# Altium schematic sheet power-amplifiers.SchDoc: Power Amplifiers
size A3; DocumentNumber: 5; SheetNumber: 5; SheetTotal: 9
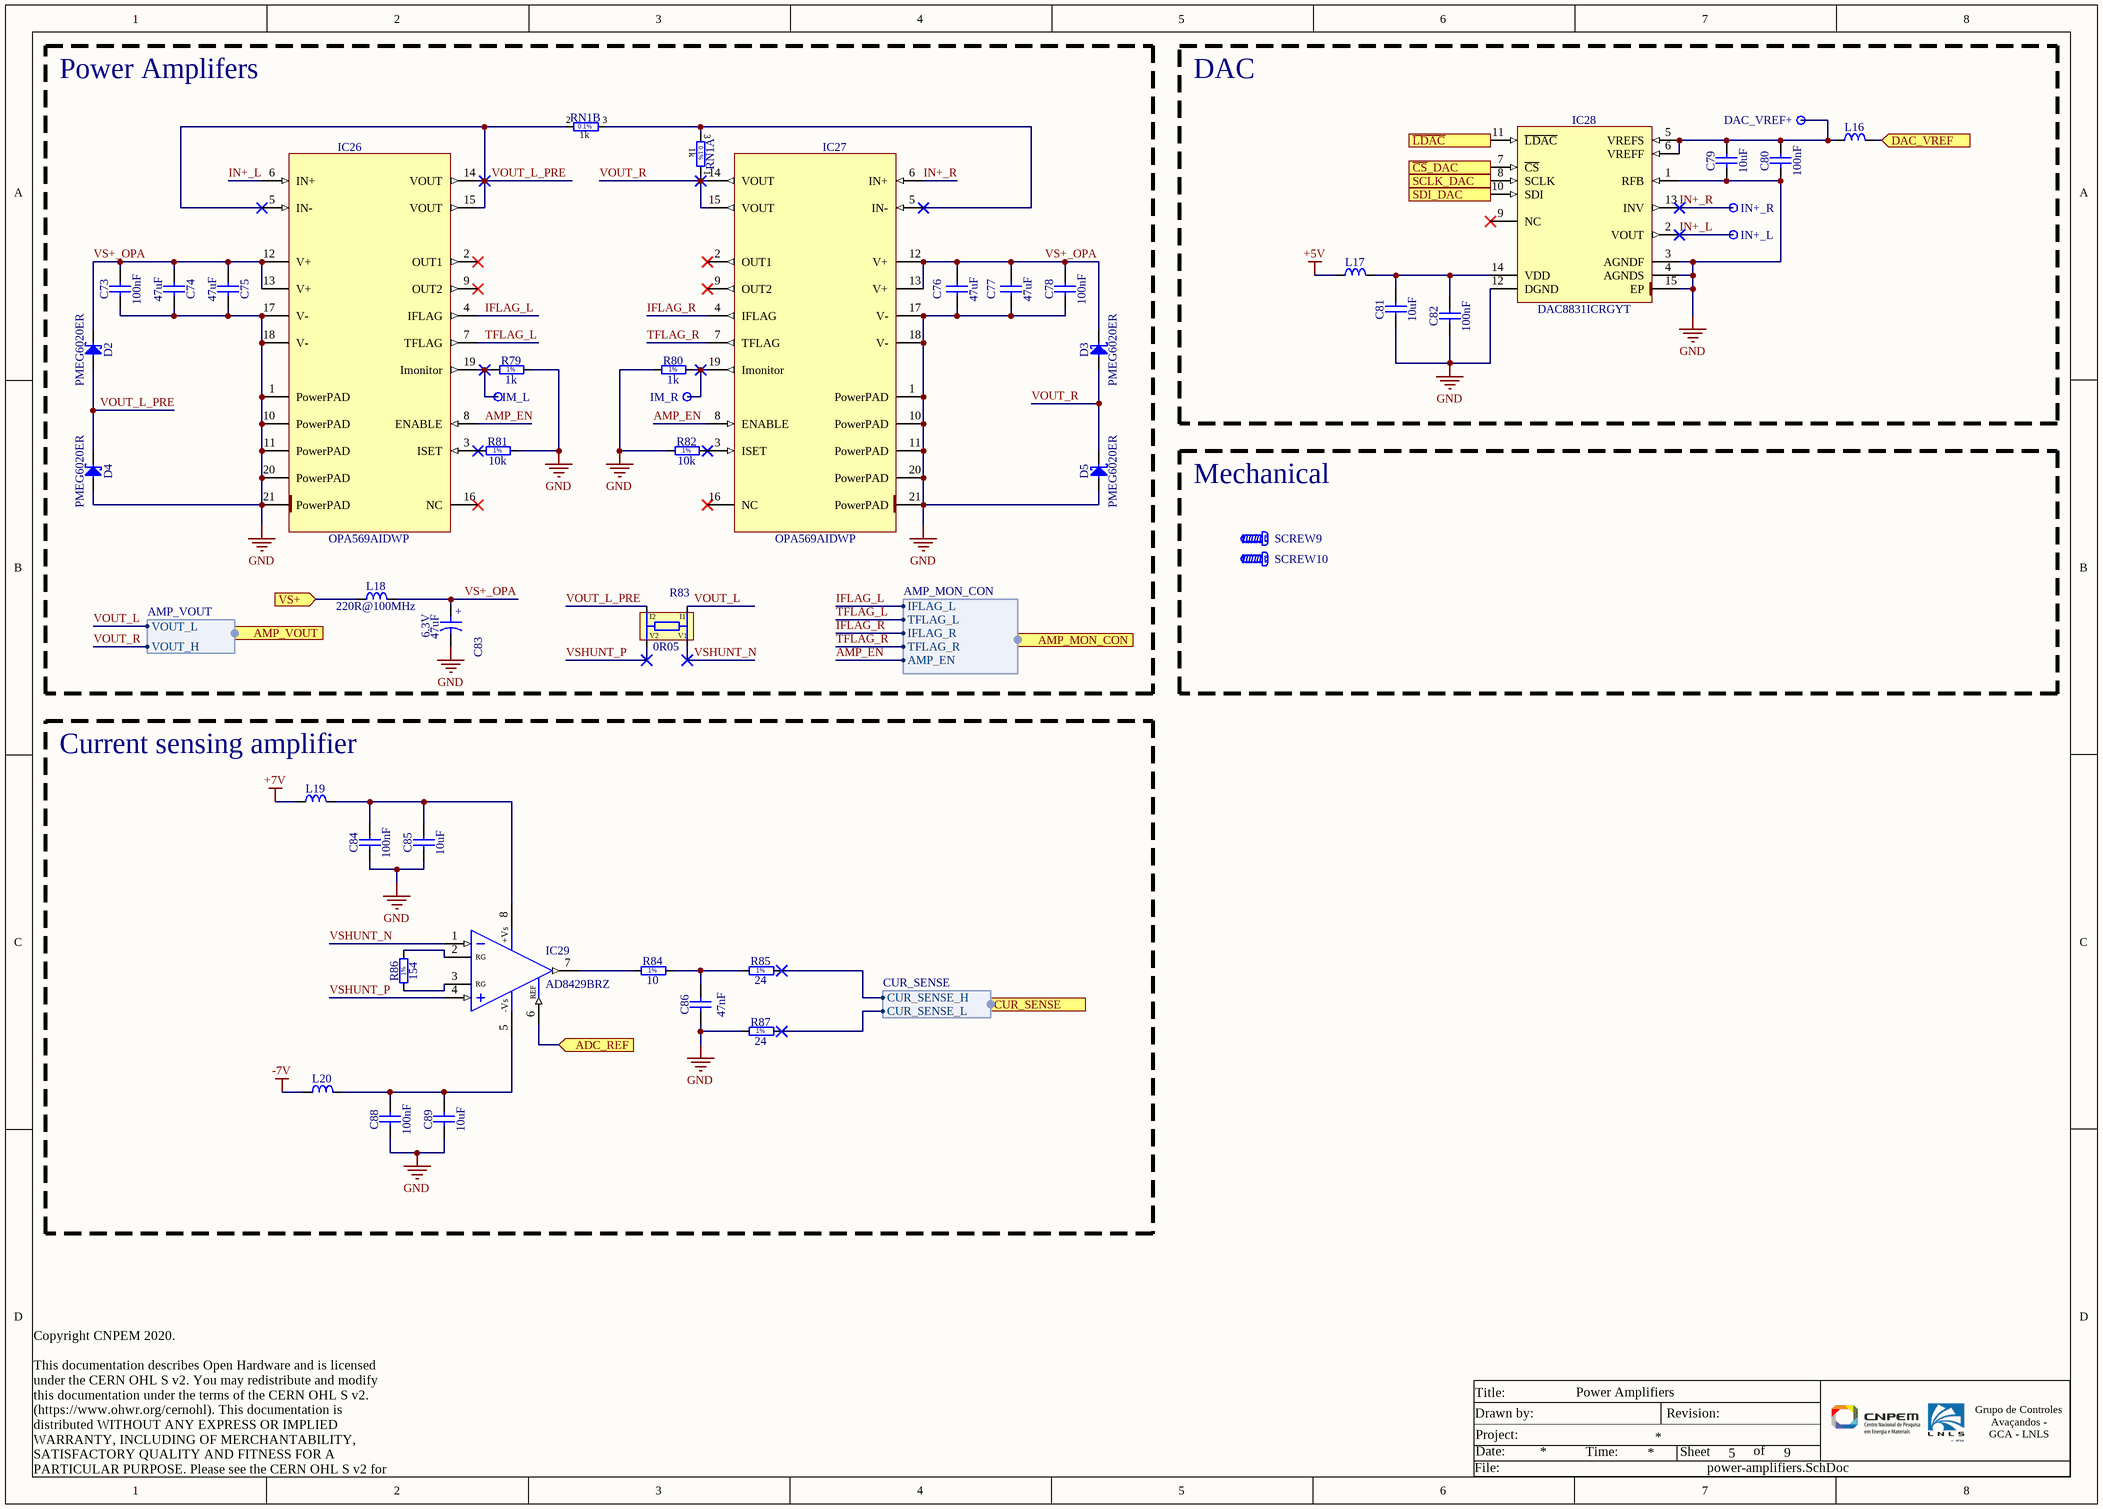
[diagram p0: power-amplifiers.SchDoc]

## Parts
C73  100nF  [CAPC1005X55N]
C74  47uF  [CAPC2012X140N]
C75  47uF  [CAPC2012X140N]
C76  47uF  [CAPC2012X140N]
C77  47uF  [CAPC2012X140N]
C78  100nF  [CAPC1005X55N]
C79  10uF  [CAPC2012X95N]
C80  100nF  [CAPC1005X55N]
C81  10uF  [CAPC2012X95N]
C82  100nF  [CAPC1005X55N]
C83  47uF  Voltage: 6.3V  [CAPMP3528X210N]
C84  100nF  [CAPC1608X87N]
C85  10uF  [CAPC2012X95N]
C86  47nF  [CAPC2012X135N]
C88  100nF  [CAPC1608X87N]
C89  10uF  [CAPC2012X95N]
D2  PMEG6020ER  [SODFL3517X110N]
D3  PMEG6020ER  [SODFL3517X110N]
D4  PMEG6020ER  [SODFL3517X110N]
D5  PMEG6020ER  [SODFL3517X110N]
DAC_VREF+  Test Point  [TPS127]  (value not drawn)
IC26  OPA569AIDWP  [SOIC127P1030X265-21N-R381X432-TB]
IC27  OPA569AIDWP  [SOIC127P1030X265-21N-R381X432-TB]
IC28  DAC8831ICRGYT  [TEXAS_RGY (S-PVQFN–N14) Simple]
IC29  AD8429BRZ  [SOIC127P600X175-8N]
IM_L  Test Point  [TPS127]  (value not drawn)
IM_R  Test Point  [TPS127]  (value not drawn)
IN+_L  Test Point  [TPS127]  (value not drawn)
IN+_R  Test Point  [TPS127]  (value not drawn)
L16  1K@100MHz  [INDC1608X95N]  (value not drawn)
L17  1K@100MHz  [INDC1608X95N]  (value not drawn)
L18  220R@100MHz  [INDC2012X105N]
L19  1K@100MHz  [INDC1608X95N]  (value not drawn)
L20  1K@100MHz  [INDC1608X95N]  (value not drawn)
R79  1k  [RESC1005X40N]
R80  1k  [RESC1005X40N]
R81  10k  [RESC1005X40N]
R82  10k  [RESC1005X40N]
R83  0R05  [RES_VISHAY_WSK1206]
R84  10  [RESC1005X40N]
R85  24  [RESC1005X40N]
R86  154  [RESC1608X55N]
R87  24  [RESC1005X40N]
RN1  1k 1k  [SOT95P230X112-3N]  (value not drawn)  (parts A,B of 2)
SCREW9  M2x6  [MCMASTERCARR_90910A922_V]  (value not drawn)
SCREW10  M2x6  [MCMASTERCARR_90910A922_V]  (value not drawn)

## Blocks framed on the sheet
Power Amplifers: C73-C78 C83 D2-D5 IC26 IC27 IM_L IM_R L18 R79-R83 RN1
DAC: C79-C82 DAC_VREF+ IC28 IN+_L IN+_R L16 L17
Mechanical: SCREW9 SCREW10
Current sensing amplifier: C84-C86 C88 C89 IC29 L19 L20 R84-R87

## Ports
ADC_REF (in), AMP_MON_CON (harness AMP_MON_CON), AMP_VOUT (harness AMP_VOUT), CUR_SENSE (harness CUR_SENSE), DAC_VREF (in), SCLK_DAC (in), SDI_DAC (in), VS+ (in), ~{CS}_DAC (in), ~{LDAC} (in)

## Harnesses
AMP_MON_CON: IFLAG_L, TFLAG_L, IFLAG_R, TFLAG_R, AMP_EN
AMP_VOUT: VOUT_L, VOUT_H
CUR_SENSE: CUR_SENSE_H, CUR_SENSE_L

## Nets
+5V: L17.1
+7V: L19.1
-7V: L20.1
GND: C73.1 C74.1 C75.1 C76.1 C77.1 C78.1 C79.1 C80.1 C81.1 C82.1 C83.2 C84.1 C85.1 C86.1 C88.1 C89.1 D4.2(A) D5.2(A) IC26.1(PowerPAD) IC26.10(PowerPAD) IC26.11(PowerPAD) IC26.17(V-) IC26.18(V-) IC26.20(PowerPAD) IC26.21(PowerPAD) IC27.1(PowerPAD) IC27.10(PowerPAD) IC27.11(PowerPAD) IC27.17(V-) IC27.18(V-) IC27.20(PowerPAD) IC27.21(PowerPAD) IC28.1(RFB) IC28.3(AGNDF) IC28.4(AGNDS) IC28.12(DGND) IC28.15(EP) R79.2 R80.1 R81.2 R82.1 R87.1
ADC_REF: IC29.6(REF) ; port ADC_REF
AMP_EN: IC26.8(ENABLE) IC27.8(ENABLE) ; port AMP_MON_CON.AMP_EN
~{CS}_DAC: IC28.7(~{CS}) ; port ~{CS}_DAC
DAC_VREF: L16.2 ; port DAC_VREF
IFLAG_L: IC26.4(IFLAG) ; port AMP_MON_CON.IFLAG_L
IFLAG_R: IC27.4(IFLAG) ; port AMP_MON_CON.IFLAG_R
IN+_L: IC26.6(IN+) IC28.2(VOUT) IN+_L.1
IN+_R: IC27.6(IN+) IC28.13(INV) IN+_R.1
~{LDAC}: IC28.11(~{LDAC}) ; port ~{LDAC}
SCLK_DAC: IC28.8(SCLK) ; port SCLK_DAC
SDI_DAC: IC28.10(SDI) ; port SDI_DAC
TFLAG_L: IC26.7(TFLAG) ; port AMP_MON_CON.TFLAG_L
TFLAG_R: IC27.7(TFLAG) ; port AMP_MON_CON.TFLAG_R
VOUT_L: R83.I1 ; port AMP_VOUT.VOUT_L
VOUT_L_PRE: D2.2(A) D4.1(C) IC26.5(IN-) IC26.14(VOUT) IC26.15(VOUT) R83.I2 RN1.2
VOUT_R: D3.2(A) D5.1(C) IC27.14(VOUT) IC27.15(VOUT) RN1.1 ; port AMP_VOUT.VOUT_H
VS+: L18.1 ; port VS+
VS+_OPA: C73.2 C74.2 C75.2 C76.2 C77.2 C78.2 C83.1 D2.1(C) D3.1(C) IC26.12(V+) IC26.13(V+) IC27.12(V+) IC27.13(V+) L18.2
VSHUNT_N: IC29.1(-IN) R83.V1
VSHUNT_P: IC29.4(+IN) R83.V2
NetC79_2: C79.2 C80.2 DAC_VREF+.1 IC28.5(VREFS) IC28.6(VREFF) L16.1
NetC81_2: C81.2 C82.2 IC28.14(VDD) L17.2
NetC84_2: C84.2 C85.2 IC29.8(+Vs) L19.2
NetC86_2: C86.2 R84.2 R85.1
NetC88_2: C88.2 C89.2 IC29.5(-Vs) L20.2
NetIC26_3: IC26.3(ISET) R81.1
NetIC26_19: IC26.19(Imonitor) IM_L.1 R79.1
NetIC27_3: IC27.3(ISET) R82.2
NetIC27_5: IC27.5(IN-) RN1.3
NetIC27_19: IC27.19(Imonitor) IM_R.1 R80.2
NetIC29_2: IC29.2(RG) R86.2
NetIC29_3: IC29.3(RG) R86.1
NetIC29_7: IC29.7(Vout) R84.1
NetR85_2: R85.2 ; port CUR_SENSE.CUR_SENSE_H
NetR87_2: R87.2 ; port CUR_SENSE.CUR_SENSE_L

Not connected (* = marked no-connect by the designer): IC26 2(OUT1)* 9(OUT2)* 16(NC)*; IC27 2(OUT1)* 9(OUT2)* 16(NC)*; IC28 9(NC)*

## Notes on the sheet
- Title:
- Date:
- Project:
- Drawn by:
- Time:
- Revision:
- Sheet
- of
- Grupo de Controles Avaçandos -
  GCA - LNLS
- Copyright CNPEM 2020.
  This documentation describes Open Hardware and is licensed under the CERN OHL S v2. You may redistribute and modify this documentation under the terms of the CERN OHL S v2. (https://www.ohwr.org/cernohl). This documentation is distributed WITHOUT ANY EXPRESS OR IMPLIED WARRANTY, INCLUDING OF MERCHANTABILITY, SATISFACTORY QUALITY AND FITNESS FOR A PARTICULAR PURPOSE. Please see the CERN OHL S v2 for applicable conditions.
- File:
- (in symbol CTE3528-21_47UF_6.3V_10%_LESR0250) +
- (in symbol MPM2001AT1, part A) 1k; 0.1%
- (in symbol MPM2001AT1, part B) 0.1%; 1k
- (in symbol R0402_1K_1%_0.0625W_100PPM) 1%
- (in symbol R0402_10K_1%_0.0625W_100PPM) 1%
- (in symbol R0402_10R_1%_0.0625W_200PPM) 1%
- (in symbol R0402_24R_1%_0.0625W_100PPM) 1%
- (in symbol R0603_154R_1%_0.063W_10PPM) 1%

## Library data of the parts
C73 C78 C80 C82 = CC0402_100NF_16V_10%_X7R: SMD Multilayer Chip Ceramic Capacitor; Manufacturer: GENERIC; Manufacturer1 Part Number: GRM155R71C104KA88D; Voltage: 16V; TC: X7R; Tolerance: ±10%; Part Number: CC0402_100NF_16V_10%_X7R; Component Kind: Standard; Component Type: Standard; Pin Count: 2; Value: 100nF; Status: Not Recommended; Manufacturer Part Number: CC0402_100NF_16V_10%_X7R; Case: 0402; Mounted: Yes; Socket: No; SMD: Yes; Sense: No; Manufacturer1 Example: MURATA; Manufacturer1 ComponentHeight: 0.55mm; HelpURL: \\cern.ch\dfs\Applications\Altium\Datasheets\CC0402_X7R_MURATA_GRM.pdf; Author: CERN DEM JLC; CreateDate: 05/12/2013; LatestRevisionDate: 03/12/2007
C74-C77 = CC0805_47UF_6.3V_20%_X5R: SMD Multilayer Chip Ceramic Capacitor; Manufacturer: GENERIC; Manufacturer1 Part Number: C0805C476M9PACTU; Voltage: 6.3V; TC: X5R; Tolerance: ±20%; Part Number: CC0805_47UF_6.3V_20%_X5R; Component Kind: Standard; Component Type: Standard; Pin Count: 2; Value: 47uF; Status: Preferred; Manufacturer Part Number: CC0805_47UF_6.3V_20%_X5R; Case: 0805; Mounted: Yes; Socket: No; SMD: Yes; Sense: No; Manufacturer1 Example: KEMET; Manufacturer1 ComponentHeight: 1.4mm; HelpURL: \\cern.ch\dfs\Applications\Altium\Datasheets\CC0805_X5R_KEMET.pdf; Author: CERN DEM JLC; CreateDate: 16/10/2012; LatestRevisionDate: 16/10/2012
C79 C81 C85 C89 = CC0805_10UF_25V_10%_X5R: SMD Multilayer Chip Ceramic Capacitor; Manufacturer: GENERIC; Manufacturer1 Part Number: GRM219R61E106KA12D; Voltage: 25V; TC: X5R; Tolerance: ±10%; Part Number: CC0805_10UF_25V_10%_X5R; Component Kind: Standard; Component Type: Standard; Pin Count: 2; Value: 10uF; Status: Preferred; Manufacturer Part Number: CC0805_10UF_25V_10%_X5R; Case: 0805; Mounted: Yes; Socket: No; SMD: Yes; Sense: No; Manufacturer1 Example: MURATA; Manufacturer1 ComponentHeight: 0.95mm; HelpURL: \\cern.ch\dfs\Applications\Altium\Datasheets\CC0805_X5R_MURATA_GRM.pdf; Author: CERN DEM JLC; CreateDate: 25/10/2012; LatestRevisionDate: 06/09/2016
C83 = CTE3528-21_47UF_6.3V_10%_LESR0250: Low ESR 0R25 Solid Tantalum Chip Capacitor; Manufacturer: GENERIC; Manufacturer1 Part Number: TPSB476K006R0250; Tolerance: ±10%; Part Number: CTE3528-21_47UF_6.3V_10%_LESR0250; Component Kind: Standard; Component Type: Standard; Pin Count: 2; Value: 47uF; Status: Preferred; Manufacturer Part Number: CTE3528-21_47UF_6.3V_10%_LESR0250; Case: B; Mounted: Yes; Socket: No; SMD: Yes; Sense: No; Manufacturer1 Example: AVX; Manufacturer1 ComponentHeight: 2.1mm; HelpURL: \\cern.ch\dfs\Applications\Altium\Datasheets\CTE-LESR_AVX_TPS.pdf; Author: CERN DEM JLC; CreateDate: 05/05/2008; LatestRevisionDate: 20/01/2009
C84 C88 = CC0603_100NF_50V_10%_X7R: SMD Multilayer Chip Ceramic Capacitor; Manufacturer: GENERIC; Manufacturer1 Part Number: 223858615649; Voltage: 50V; TC: X7R; Tolerance: ±10%; Part Number: CC0603_100NF_50V_10%_X7R; Component Kind: Standard; Component Type: Standard; Pin Count: 2; Value: 100nF; Status: Preferred; Manufacturer Part Number: CC0603_100NF_50V_10%_X7R; Case: 0603; Mounted: Yes; Socket: No; SMD: Yes; Sense: No; Manufacturer1 Example: PHYCOMP; Manufacturer1 ComponentHeight: 0.87mm; HelpURL: \\cern.ch\dfs\Applications\Altium\Datasheets\CC0603_X7R_PHYCOMP.pdf; Author: CERN DEM JLC; CreateDate: 03/12/2007; LatestRevisionDate: 03/12/2007
C86 = CC0805_47NF_25V_5%_C0G_KEMET_C0805X473J3GECAUTO: SMD Multilayer Chip Ceramic Capacitor, C0G dielectric, Flexible termination; Manufacturer: KEMET; Voltage: 25V; Tolerance: ±5%; Part Number: CC0805_47NF_25V_5%_C0G_KEMET_C0805X473J3GECAUTO; Component Kind: Standard; Component Type: Standard; Pin Count: 2; Value: 47nF; Status: None; TC: C0G; Manufacturer Part Number: C0805X473J3GECAUTO; Case: 0805; Mounted: Yes; Socket: No; SMD: Yes; Sense: No; ComponentHeight: 1.25mm; Author: LNLS DIG AFG; CreateDate: 16/10/2020; LatestRevisionDate: 16/10/2020
D2-D5 = PMEG6020ER: MEGA Schottky Barrier Rectifier; Manufacturer: NXP SEMICONDUCTORS; Voltage: 60V; Power: 2A; PressFit: No; Bonding: No; Part Number: PMEG6020ER; Component Kind: Standard; Component Type: Standard; Device: PMEG6020ER; PackageDescription: SODFL Diode (SOD123W); 2.60mm W X 1.70mm L X 1.10mm H body, IPC Medium Density; Manufacturer Part Number: PMEG6020ER; Pin Count: 2; Case: SOD123; Mounted: Yes; Socket: No; SMD: Yes; Sense: No; ComponentHeight: 0.65mm; HelpURL: \\cern.ch\dfs\Applications\Altium\Datasheets\PMEG6020ER.pdf; Author: CERN DEM JMW; CreateDate: 19/06/2014; LatestRevisionDate: 19/06/2014
DAC_VREF+ IM_L IM_R IN+_L IN+_R = SMD_PAD_1.27X1.27MM: 1.27mm x 1.27mm PCB Copper Area (SMD Test Point); Mounted: No; Part Number: SMD_PAD_1.27X1.27MM; Component Kind: Standard (No BOM); Component Type: Standard (No BOM); Pin Count: 1; Family: Test Point; Socket: No; SMD: Yes; Sense: No; Status: None; ComponentHeight: 0mm; HelpURL: Undefined; Author: CERN DEM JLC; CreateDate: 12/01/2008; LatestRevisionDate: 12/01/2008; PackageDescription: 1.27mm x 1.27mm PCB Copper Area (SMD Test Point)
IC26 IC27 = OPA569AIDWP_HEATSINK: Rail-to-Rail I/O, 2A, Power amplifier; Manufacturer: TEXAS INSTRUMENTS; PressFit: No; Bonding: No; Part Number: OPA569AIDWP_HEATSINK; Component Kind: Standard; Component Type: Standard; Device: OPA569AIDWP; PackageDescription: SOIC 20, Pitch 1.27mm - Body 7.5x12.9mm, (w/thermal tab 3.81mm X 4.32mm), IPC Medium Density; Manufacturer Part Number: OPA569AIDWP; Pin Count: 21; Case: SOIC20; Mounted: Yes; Socket: No; SMD: Yes; Sense: No; ComponentHeight: 2.65mm; Author: LNLS DIG AFG; CreateDate: 12/07/2020; LatestRevisionDate: 12/07/2020
IC28 = DAC8831ICRGYT: 16-Bit, Ultra-Low Power, Voltage-Output Digital-to-Analog Converter; Manufacturer: TEXAS INSTRUMENTS; PressFit: No; Bonding: No; Part Number: DAC8831ICRGYT; Component Kind: Standard; Component Type: Standard; Device: DAC8831ICRGYT; Footprint: TEXAS_RGY (S-PVQFN–N14); PackageDescription: TEXAS Case Style RGY (S-PVQFN-N14), QFN, 0.50mm Pitch, Square; 14 Pin, 3.5mm L X 3.5mm W X 1.00mm H body (w/thermal tab 2.15 X 2.15mm); Manufacturer Part Number: DAC8831ICRGYT; Pin Count: 15; Case: QFN14; Mounted: Yes; Socket: No; SMD: Yes; Sense: No; ComponentHeight: 1mm; Author: LNLS DIG LOS; CreateDate: 13/06/2018; LatestRevisionDate: 20/12/2021
IC29 = AD8429BRZ: 1nV/sqrt Hz Low Noise Instrumentation Amplifier; Manufacturer: ANALOG DEVICES; PressFit: No; Bonding: No; Part Number: AD8429BRZ; Component Kind: Standard; Component Type: Standard; Device: AD8429BRZ; PackageDescription: SOIC 8, Pitch 1.27mm - Body 4x5mm, IPC Medium Density; Manufacturer Part Number: AD8429BRZ; Pin Count: 8; Case: SOIC8; Mounted: Yes; Socket: No; SMD: Yes; Sense: No; ComponentHeight: 1.75mm; Author: CERN DEM JLC; HelpURL: \\cern.ch\dfs\Applications\Altium\Datasheets\AD8429BRZ.pdf; CreateDate: 31/08/2011; LatestRevisionDate: 31/08/2011
L16 L17 L19 L20 = IND0603_MURATA_BLM18AG102SN1D: SMD EMIFIL Suppression Chip Ferrite Bead; Manufacturer: MURATA; Power: 400mA; Resistance: 0.50R; Tolerance: ±25%; Part Number: IND0603_MURATA_BLM18AG102SN1D; Component Kind: Standard; Component Type: Standard; Pin Count: 2; Value: 1K@100MHz; Status: None; Manufacturer Part Number: BLM18AG102SN1D; Case: 0603; Mounted: Yes; Socket: No; SMD: Yes; Sense: No; ComponentHeight: 0.95mm; Author: LNLS DIG GBMB; CreateDate: 03/11/2017; LatestRevisionDate: 03/11/2017
L18 = IND0805_MURATA_BLM21PG221SN1D: SMD EMIFIL Suppression Chip Ferrite Bead; Manufacturer: MURATA; Power: 2A; Resistance: 0.05R; Tolerance: ±25%; Part Number: IND0805_MURATA_BLM21PG221SN1D; Component Kind: Standard; Component Type: Standard; Pin Count: 2; Value: 220R@100MHz; Status: None; Manufacturer Part Number: BLM21PG221SN1D; Case: 0805; Mounted: Yes; Socket: No; SMD: Yes; Sense: No; ComponentHeight: 1.05mm; HelpURL: \\cern.ch\dfs\Applications\Altium\Datasheets\IND0402_MURATA_BLM21P.pdf; Author: CERN DEM JLC; CreateDate: 25/01/2010; LatestRevisionDate: 25/01/2010
R79 R80 = R0402_1K_1%_0.0625W_100PPM: General Purpose Thick Film Chip Resistor; Manufacturer: GENERIC; Manufacturer1 Part Number: 232270671002L; TC: ±100ppm/°C; Tolerance: ±1%; Part Number: R0402_1K_1%_0.0625W_100PPM; Component Kind: Standard; Component Type: Standard; Pin Count: 2; Value: 1k; Status: Not recommended; Power: 0.0625W; Manufacturer Part Number: R0402_1K_1%_0.0625W_100PPM; Case: 0402; Mounted: Yes; Sense: No; Socket: No; SMD: Yes; Manufacturer1 Example: YAGEO PHYCOMP; Manufacturer1 ComponentHeight: 0.4mm; HelpURL: \\cern.ch\dfs\Applications\Altium\Datasheets\R0402_Phycomp_RC0402.pdf; Author: CERN DEM JLC; CreateDate: 03/12/2007; LatestRevisionDate: 17/10/2012
R81 R82 = R0402_10K_1%_0.0625W_100PPM: General Purpose Thick Film Chip Resistor; Manufacturer: GENERIC; Manufacturer1 Part Number: 232270671003L; TC: ±100ppm/°C; Tolerance: ±1%; Part Number: R0402_10K_1%_0.0625W_100PPM; Component Kind: Standard; Component Type: Standard; Pin Count: 2; Value: 10k; Status: Not recommended; Power: 0.0625W; Manufacturer Part Number: R0402_10K_1%_0.0625W_100PPM; Case: 0402; Mounted: Yes; Sense: No; Socket: No; SMD: Yes; Manufacturer1 Example: YAGEO PHYCOMP; Manufacturer1 ComponentHeight: 0.4mm; HelpURL: \\cern.ch\dfs\Applications\Altium\Datasheets\R0402_Phycomp_RC0402.pdf; Author: CERN DEM JLC; CreateDate: 03/12/2007; LatestRevisionDate: 17/10/2012
R83 = R1206_0R05_1%_0.5W_35PPM_VISHAY: Four Terminal Current Sense; Manufacturer: Vishay; Manufacturer Part Number: WSK1206R0500FEA18; Power: 0.5W; TC: ±35ppm/°C; Tolerance: ±1%; Part Number: R1206_0R05_1%_0.5W_35PPM_VISHAY; Component Kind: Standard; Component Type: Standard; Pin Count: 4; Value: 0R05; Status: None; Case: WSK1206; Mounted: Yes; Sense: No; Socket: No; SMD: Yes; ComponentHeight: 0.7mm; Author: LNLS DIG GBMB; CreateDate: 05/11/2018; LatestRevisionDate: 05/11/2018
R84 = R0402_10R_1%_0.0625W_200PPM: General Purpose Thick Film Chip Resistor; Manufacturer: GENERIC; Manufacturer1 Part Number: 232270671009L; TC: ±200ppm/°C; Tolerance: ±1%; Part Number: R0402_10R_1%_0.0625W_200PPM; Component Kind: Standard; Component Type: Standard; Pin Count: 2; Value: 10; Status: Not recommended; Power: 0.0625W; Manufacturer Part Number: R0402_10R_1%_0.0625W_200PPM; Case: 0402; Mounted: Yes; Sense: No; Socket: No; SMD: Yes; Manufacturer1 Example: YAGEO PHYCOMP; Manufacturer1 ComponentHeight: 0.4mm; HelpURL: \\cern.ch\dfs\Applications\Altium\Datasheets\R0402_Phycomp_RC0402.pdf; Author: CERN DEM JLC; CreateDate: 24/06/2009; LatestRevisionDate: 17/10/2012
R85 R87 = R0402_24R_1%_0.0625W_100PPM: General Purpose Thick Film Chip Resistor; Manufacturer: GENERIC; Manufacturer1 Part Number: 232270672409L; TC: ±100ppm/°C; Tolerance: ±1%; Part Number: R0402_24R_1%_0.0625W_100PPM; Component Kind: Standard; Component Type: Standard; Pin Count: 2; Value: 24; Status: Not recommended; Power: 0.0625W; Manufacturer Part Number: R0402_24R_1%_0.0625W_100PPM; Case: 0402; Mounted: Yes; Sense: No; Socket: No; SMD: Yes; Manufacturer1 Example: YAGEO PHYCOMP; Manufacturer1 ComponentHeight: 0.4mm; HelpURL: \\cern.ch\dfs\Applications\Altium\Datasheets\R0402_Phycomp_RC0402.pdf; Author: CERN DEM JLC; CreateDate: 03/12/2007; LatestRevisionDate: 17/10/2012
R86 = R0603_154R_1%_0.063W_10PPM: General Purpose Thick Film Chip Resistor; Manufacturer: GENERIC; Manufacturer Part Number: R0603_154R_1%_0.1W_100PPM; Manufacturer1 Part Number: RC0603FR-07154RL; Power: 0.1W; TC: ±100ppm; Tolerance: ±1%; Part Number: R0603_154R_1%_0.063W_10PPM; Component Kind: Standard; Component Type: Standard; Pin Count: 2; Value: 154; Case: 0603; Mounted: Yes; Sense: No; Socket: No; SMD: Yes; Manufacturer1 Example: YAGEO PHYCOMP; Manufacturer1 ComponentHeight: 0.6mm; Author: LNLS DIG GBMB; CreateDate: 05/11/2018; LatestRevisionDate: 05/11/2018
RN1 = MPM2001AT1: Divider, Thin Film Resistors Network; Manufacturer: VISHAY THIN FILM; Power: 0.1W; TC: ±25ppm/°C; Tolerance: ±0.1%; Voltage: 100V; Part Number: MPM2001AT1; Component Kind: Standard; Component Type: Standard; Pin Count: 3; Value: 1k 1k; Sense: no; Manufacturer Part Number: MPM2001AT1; Case: SOT23-3; Mounted: Yes; Socket: No; SMD: Yes; ComponentHeight: 1.22mm; HelpURL: \\cern.ch\dfs\Applications\Altium\Datasheets\RN_VISHAY_MPM.pdf; Author: LNLS DIG AFG; CreateDate: 11/05/2020; LatestRevisionDate: 11/05/2020
SCREW9 SCREW10 = MCMASTERCARR_90910A922_v: M2 L=6mm Torx Socket Pan Head Screw, Fully Threaded - Stainless Steel; Manufacturer: MCMASTER-CARR; PressFit: No; Part Number: MCMASTERCARR_90910A922_v; Component Kind: Standard; Component Type: Mechanical; Pin Count: 0; PackageDescription: M2 L=6mm Hexalobular Socket Pan Head Screw, Fully Threaded - Stainless Steel; Mounted: Yes; Socket: No; SMD: No; Sense: No; Status: None; Value: M2x6; Manufacturer Part Number: 90910A922; ComponentHeight: 7.1mm; Author: LNLS DIG AFG; CreateDate: 05/08/2020; LatestRevisionDate: 05/08/2020